# EAGLE schematic stepperDriverTop (EAGLE 9.6.2)

## Sheet 1 of 3: Motor Driver
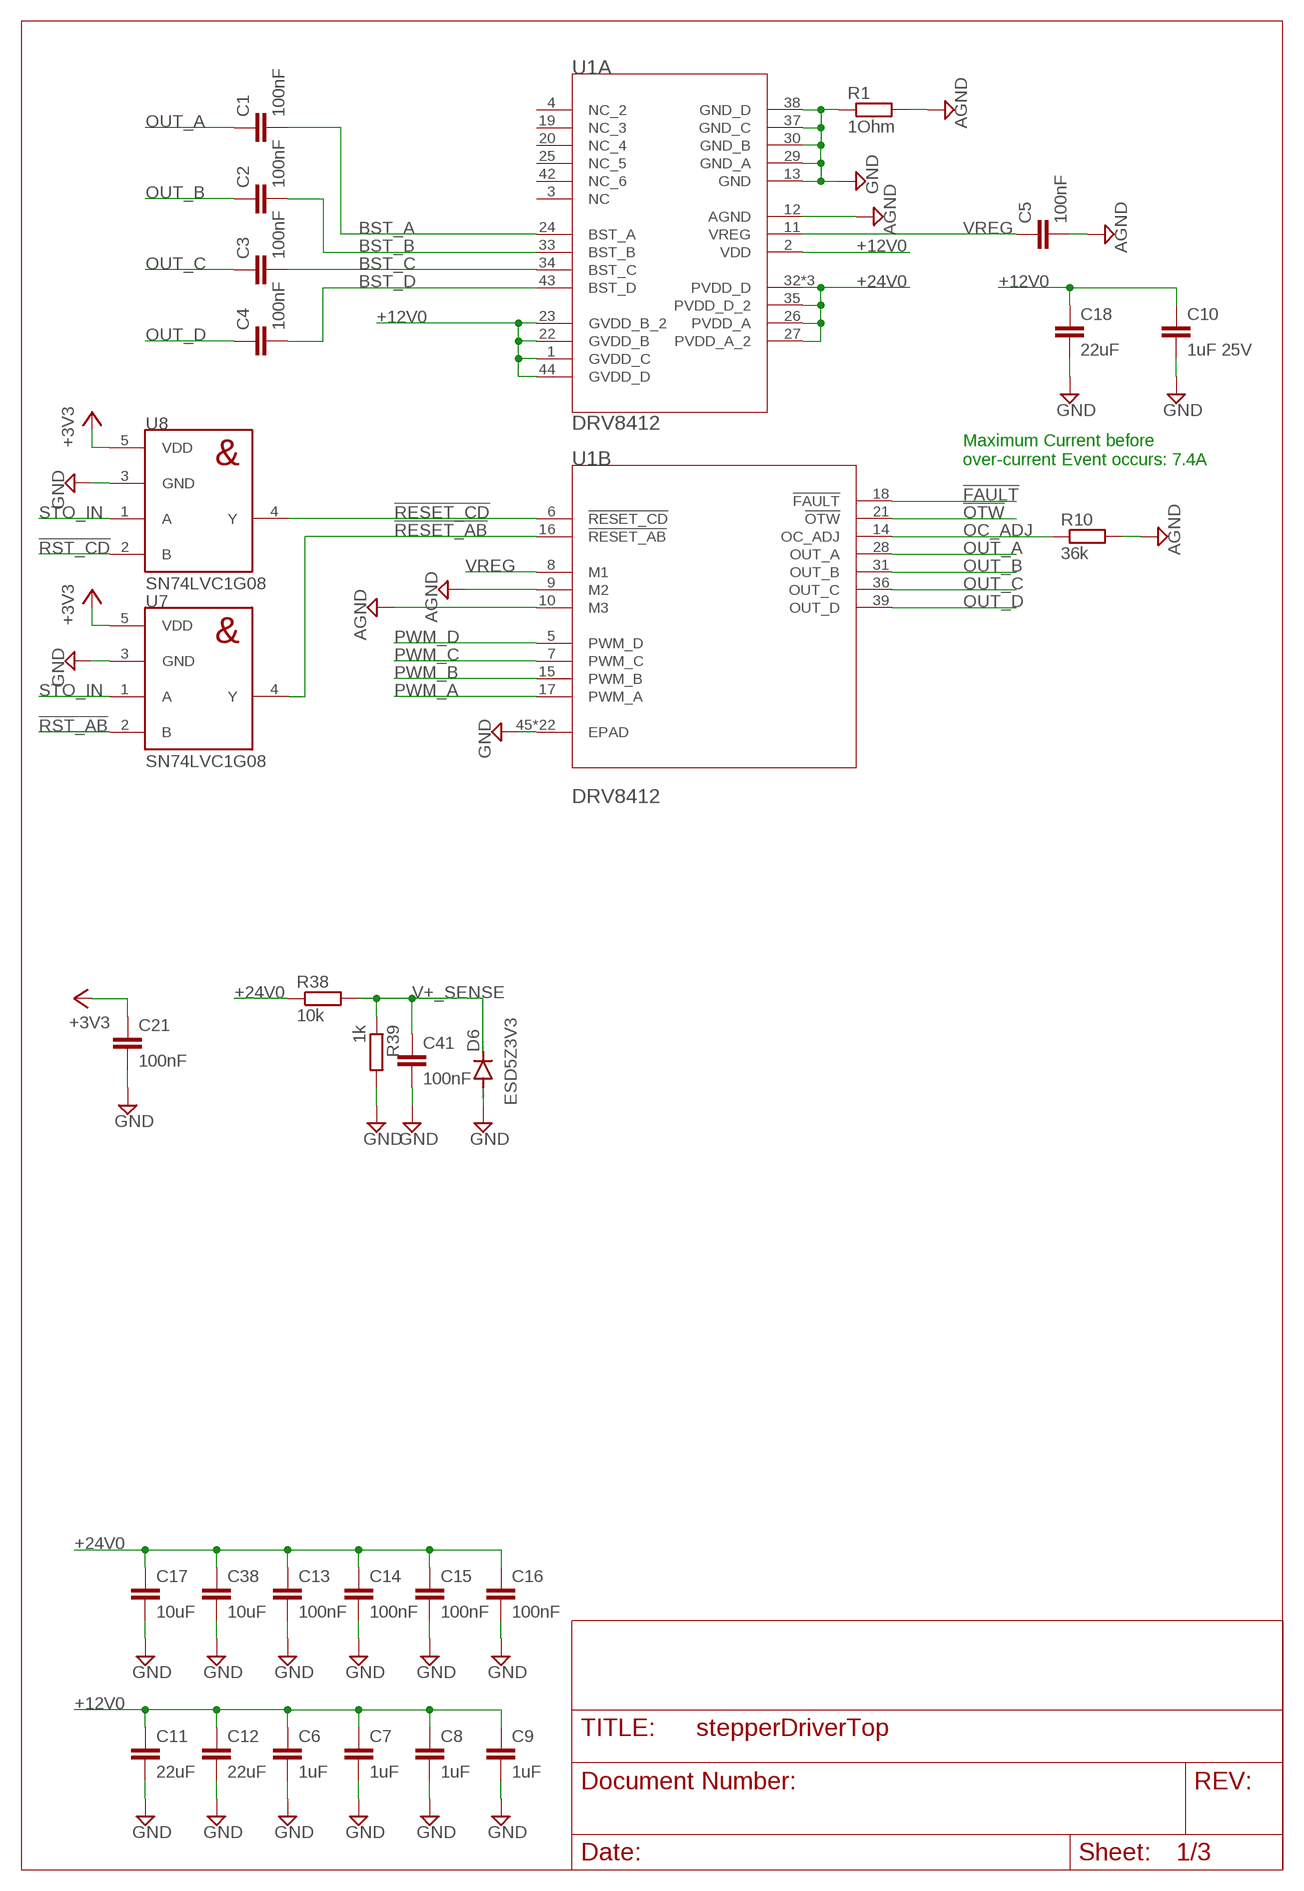
[diagram p0: schematic, sheet 1]

### Parts
C1  100nF  C-EUC0603  [C0603]
C2  100nF  C-EUC0603  [C0603]
C3  100nF  C-EUC0603  [C0603]
C4  100nF  C-EUC0603  [C0603]
C5  100nF  C-EUC0402  [C0402]
C6  1uF  C-EUC0402  [C0402]
C7  1uF  C-EUC0402  [C0402]
C8  1uF  C-EUC0402  [C0402]
C9  1uF  C-EUC0402  [C0402]
C10  1uF 25V  C-EUC0402  [C0402]
C11  22uF  C-EUC0805  [C0805]
C12  22uF  C-EUC0805  [C0805]
C13  100nF  C-EUC0402  [C0402]
C14  100nF  C-EUC0402  [C0402]
C15  100nF  C-EUC0402  [C0402]
C16  100nF  C-EUC0402  [C0402]
C17  10uF  C-EUC1206  [C1206]
C18  22uF  C-EUC0805  [C0805]
C21  100nF  C-EUC0402  [C0402]
C38  10uF  C-EUC1206  [C1206]
C41  100nF  C-EUC0402  [C0402]
D6  ESD5Z3V3  DIODE-SOD523  [SOD523]
R1  1Ohm  R-EU_R0402  [R0402]
R10  36k  R-EU_R0402  [R0402]
R38  10k  R-EU_R0402  [R0402]
R39  1k  R-EU_R0402  [R0402]
U1  DRV8412  DRV8412DDW44  [SOP63P810X120-45T350X740N]
U7  SN74LVC1G08  [SOT95P240X110-5]
U8  SN74LVC1G08  [SOT95P240X110-5]

### Nets
!FAULT: U1.18(B:!FAULT) ; also sheet 2
!OTW: U1.21(B:!OTW) ; also sheet 2
!RESET_AB: U1.16(B:!RESET_AB) U7.4(Y)
!RESET_CD: U1.6(B:!RESET_CD) U8.4(Y)
!RST_AB: U7.2(B) ; also sheet 2
!RST_CD: U8.2(B) ; also sheet 2
+3V3: C21.1 U7.5(VDD) U8.5(VDD) ; also sheet 2,3
+12V0: C6.1 C7.1 C8.1 C9.1 C10.1 C11.1 C12.1 C18.1 U1.1(A:GVDD_C) U1.2(A:VDD) U1.22(A:GVDD_B) U1.23(A:GVDD_B_2) U1.44(A:GVDD_D) ; also sheet 3
+24V0: C13.1 C14.1 C15.1 C16.1 C17.1 C38.1 R38.1 U1.26(A:PVDD_A) U1.27(A:PVDD_A_2) U1.32(A:PVDD_D) U1.35(A:PVDD_D_2) U1.40(A:PVDD_D) U1.41(A:PVDD_D) ; also sheet 3
AGND: C5.2 R1.2 R10.2 U1.9(B:M2) U1.10(B:M3) U1.12(A:AGND)
BST_A: C1.2 U1.24(A:BST_A)
BST_B: C2.2 U1.33(A:BST_B)
BST_C: C3.2 U1.34(A:BST_C)
BST_D: C4.2 U1.43(A:BST_D)
GND: C6.2 C7.2 C8.2 C9.2 C10.2 C11.2 C12.2 C13.2 C14.2 C15.2 C16.2 C17.2 C18.2 C21.2 C38.2 C41.2 D6.A R1.1 R39.2 U1.13(A:GND) U1.29(A:GND_A) U1.30(A:GND_B) U1.37(A:GND_C) U1.38(A:GND_D) U1.45(B:EPAD) U1.V_1(B:EPAD) U1.V_2(B:EPAD) U1.V_3(B:EPAD) U1.V_4(B:EPAD) U1.V_5(B:EPAD) U1.V_6(B:EPAD) U1.V_7(B:EPAD) U1.V_8(B:EPAD) U1.V_9(B:EPAD) U1.V_10(B:EPAD) U1.V_11(B:EPAD) U1.V_12(B:EPAD) U1.V_13(B:EPAD) U1.V_14(B:EPAD) U1.V_15(B:EPAD) U1.V_16(B:EPAD) U1.V_17(B:EPAD) U1.V_18(B:EPAD) U1.V_19(B:EPAD) U1.V_20(B:EPAD) U1.V_21(B:EPAD) U7.3(GND) U8.3(GND) ; also sheet 2,3
OC_ADJ: R10.1 U1.14(B:OC_ADJ)
OUT_A: C1.1 U1.28(B:OUT_A) ; also sheet 3
OUT_B: C2.1 U1.31(B:OUT_B) ; also sheet 3
OUT_C: C3.1 U1.36(B:OUT_C) ; also sheet 3
OUT_D: C4.1 U1.39(B:OUT_D) ; also sheet 3
PWM_A: U1.17(B:PWM_A) ; also sheet 2
PWM_B: U1.15(B:PWM_B) ; also sheet 2
PWM_C: U1.7(B:PWM_C) ; also sheet 2
PWM_D: U1.5(B:PWM_D) ; also sheet 2
STO_IN: U7.1(A) U8.1(A) ; also sheet 2,3
V+_SENSE: C41.1 D6.C R38.2 R39.1 ; also sheet 2
VREG: C5.1 U1.8(B:M1) U1.11(A:VREG)
Unconnected: U1.3(A:NC) U1.4(A:NC_2) U1.19(A:NC_3) U1.20(A:NC_4) U1.25(A:NC_5) U1.42(A:NC_6)

### Notes on the sheet
- Maximum Current before 
  over-current Event occurs: 7.4A

## Sheet 2 of 3: Microcontroller
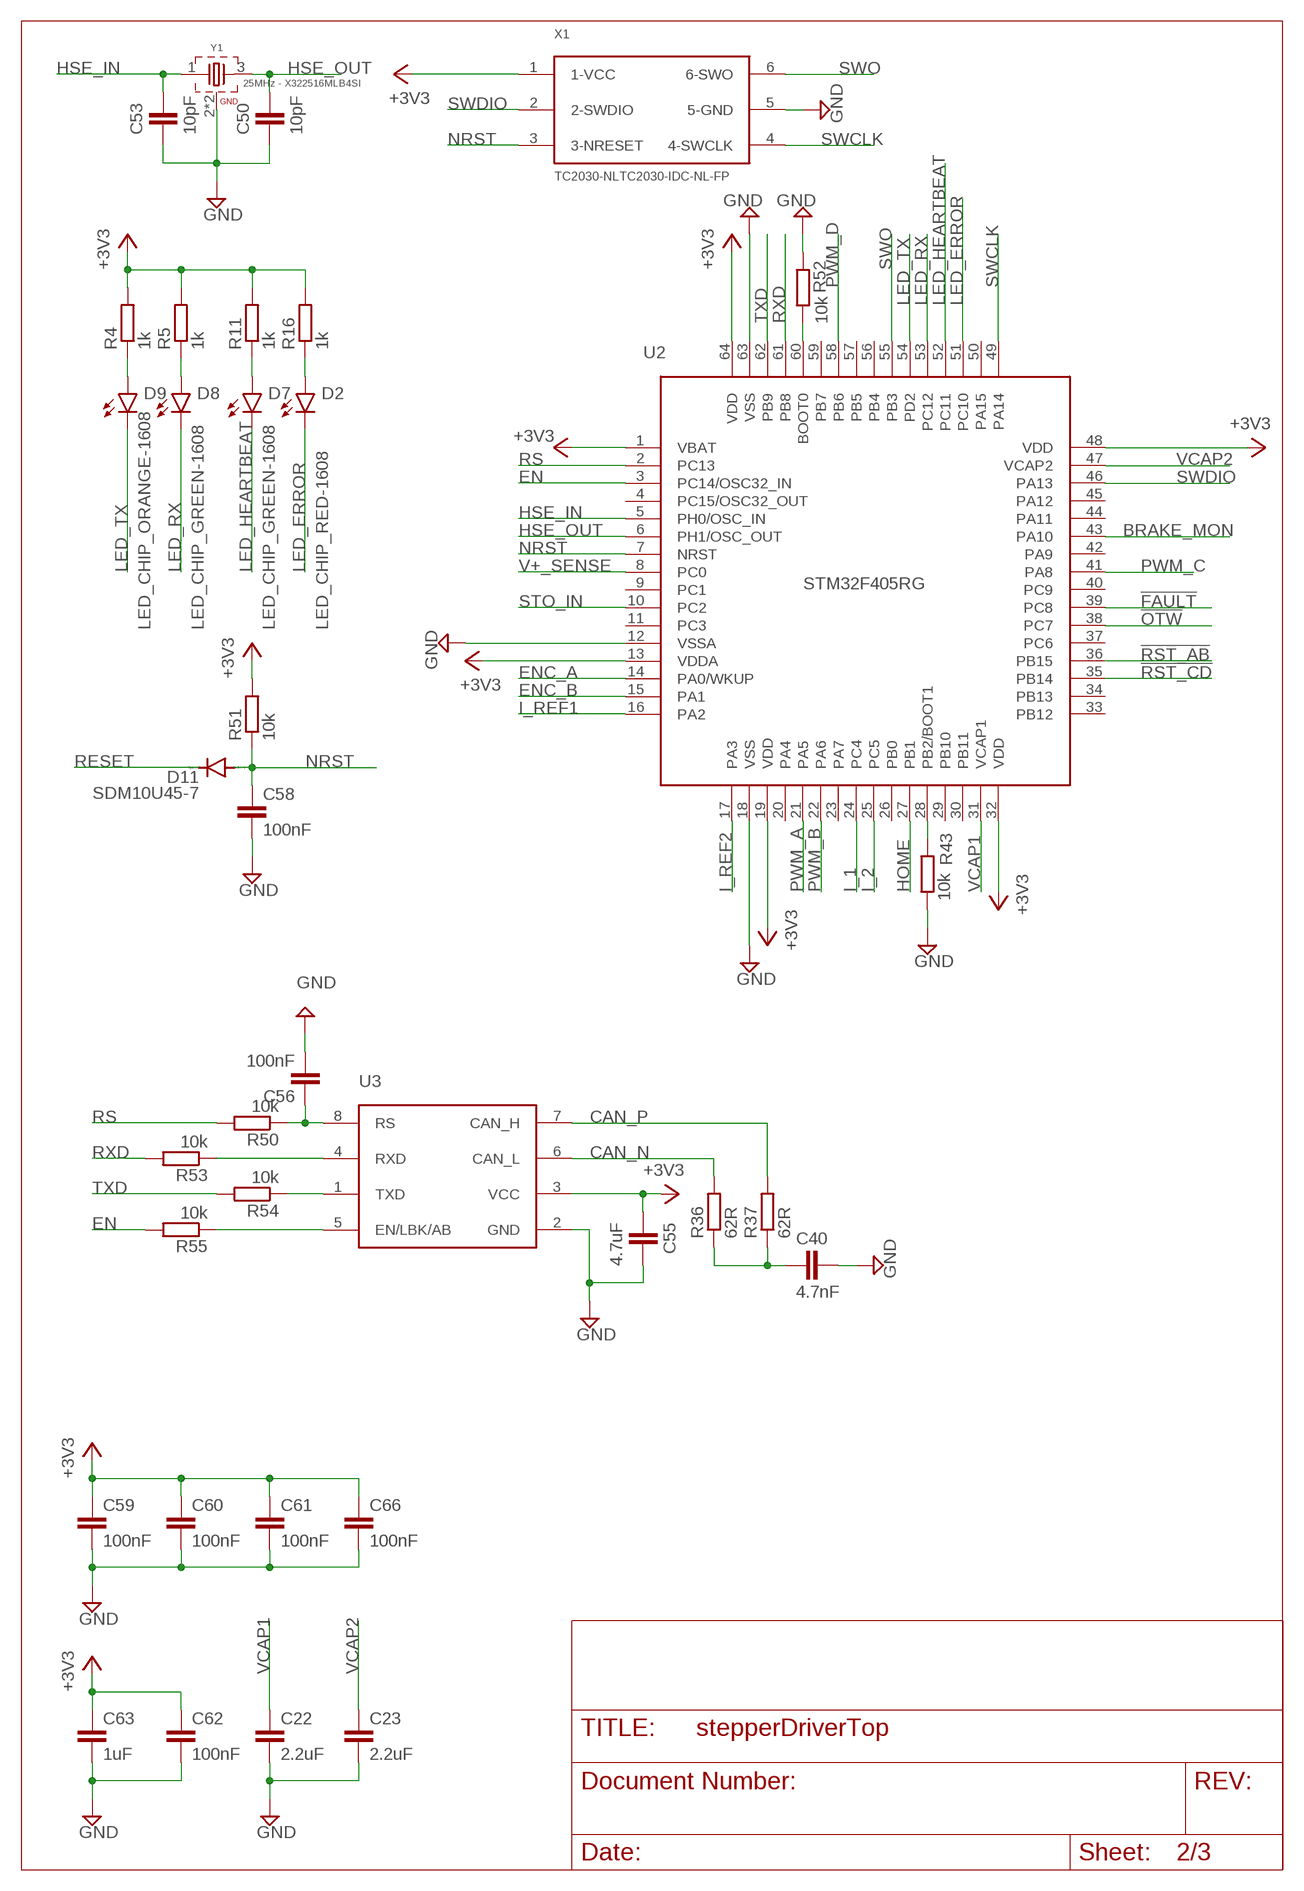
[diagram p1: schematic, sheet 2]

### Parts
C22  2.2uF  C-EUC0603  [C0603]
C23  2.2uF  C-EUC0603  [C0603]
C40  4.7nF  C-EUC0402  [C0402]
C50  10pF  C-EUC0402  [C0402]
C53  10pF  C-EUC0402  [C0402]
C55  4.7uF  C-EUC0402  [C0402]
C56  100nF  C-EUC0402  [C0402]
C58  100nF  C-EUC0402  [C0402]
C59  100nF  C-EUC0402  [C0402]
C60  100nF  C-EUC0402  [C0402]
C61  100nF  C-EUC0402  [C0402]
C62  100nF  C-EUC0402  [C0402]
C63  1uF  C-EUC0402  [C0402]
C66  100nF  C-EUC0402  [C0402]
D2  LED_CHIP_RED-1608  [LEDC1608X39N_R]
D7  LED_CHIP_GREEN-1608  [LEDC1608X39N_G]
D8  LED_CHIP_GREEN-1608  [LEDC1608X39N_G]
D9  LED_CHIP_ORANGE-1608  LED_CHIP_GREEN-1608  [LEDC1608X39N_G]
D11  SDM10U45-7  DIODE-SOD523  [SOD523]
R4  1k  R-EU_R0402  [R0402]
R5  1k  R-EU_R0402  [R0402]
R11  1k  R-EU_R0402  [R0402]
R16  1k  R-EU_R0402  [R0402]
R36  62R  R-EU_R0603  [R0603]
R37  62R  R-EU_R0603  [R0603]
R43  10k  R-EU_R0402  [R0402]
R50  10k  R-EU_R0402  [R0402]
R51  10k  R-EU_R0402  [R0402]
R52  10k  R-EU_R0402  [R0402]
R53  10k  R-EU_R0402  [R0402]
R54  10k  R-EU_R0402  [R0402]
R55  10k  R-EU_R0402  [R0402]
U2  STM32F405RGLQFP64  [QFP50P1200X1200X120-64]
U3  SN65HVD23X-Q1D0008A  [SOIC127P599X175-8N]
X1  TC2030-NLTC2030-IDC-NL-FP  [TC2030-NL]
Y1  25MHz - X322516MLB4SI  WE-XTAL_CFPX-180_830059800  [WE-XTAL_CFPX-180]

### Nets
!FAULT: U2.39(PC8) ; also sheet 1
!OTW: U2.38(PC7) ; also sheet 1
!RST_AB: U2.36(PB15) ; also sheet 1
!RST_CD: U2.35(PB14) ; also sheet 1
+3V3: C55.2 C59.1 C60.1 C61.1 C62.1 C63.1 C66.1 R4.2 R5.2 R11.2 R16.2 R51.2 U2.1(VBAT) U2.13(VDDA) U2.19(VDD) U2.32(VDD) U2.48(VDD) U2.64(VDD) U3.3(VCC) X1.1(1-VCC) ; also sheet 1,3
BRAKE_MON: U2.43(PA10) ; also sheet 3
CAN_N [diff pairs]: R36.2 U3.6(CAN_L) ; also sheet 3
CAN_P [diff pairs]: R37.2 U3.7(CAN_H) ; also sheet 3
EN: R55.2 U2.3(PC14/OSC32_IN)
ENC_A: U2.14(PA0/WKUP) ; also sheet 3
ENC_B: U2.15(PA1) ; also sheet 3
GND: C22.2 C23.2 C40.1 C50.2 C53.2 C55.1 C56.2 C58.2 C59.2 C60.2 C61.2 C62.2 C63.2 C66.2 R43.1 R52.1 U2.12(VSSA) U2.18(VSS) U2.63(VSS) U3.2(GND) X1.5(5-GND) Y1.2(GND) Y1.4(GND) ; also sheet 1,3
HOME: U2.27(PB1) ; also sheet 3
HSE_IN: C53.1 U2.5(PH0/OSC_IN) Y1.1
HSE_OUT: C50.1 U2.6(PH1/OSC_OUT) Y1.3
I_1: U2.24(PC4) ; also sheet 3
I_2: U2.25(PC5) ; also sheet 3
I_REF1: U2.16(PA2) ; also sheet 3
I_REF2: U2.17(PA3) ; also sheet 3
LED_ERROR: D2.1(C) U2.51(PC10)
LED_HEARTBEAT: D7.1(C) U2.52(PC11)
LED_RX: D8.1(C) U2.53(PC12)
LED_TX: D9.1(C) U2.54(PD2)
N$1: D9.2(A) R4.1
N$2: D8.2(A) R5.1
N$3: D7.2(A) R11.1
N$4: D2.2(A) R16.1
N$21: C40.2 R36.1 R37.1
N$24: R43.2 U2.28(PB2/BOOT1)
N$25: R52.2 U2.60(BOOT0)
N$26: C56.1 R50.1 U3.8(RS)
N$27: R53.1 U3.4(RXD)
N$28: R54.1 U3.1(TXD)
N$29: R55.1 U3.5(EN/LBK/AB)
NRST: C58.1 D11.A R51.1 U2.7(NRST) X1.3(3-NRESET)
PWM_A: U2.21(PA5) ; also sheet 1
PWM_B: U2.22(PA6) ; also sheet 1
PWM_C: U2.41(PA8) ; also sheet 1
PWM_D: U2.58(PB6) ; also sheet 1
RESET: D11.C
RS: R50.2 U2.2(PC13)
RXD: R53.2 U2.61(PB8)
STO_IN: U2.10(PC2) ; also sheet 1,3
SWCLK: U2.49(PA14) X1.4(4-SWCLK)
SWDIO: U2.46(PA13) X1.2(2-SWDIO)
SWO: U2.55(PB3) X1.6(6-SWO)
TXD: R54.2 U2.62(PB9)
V+_SENSE: U2.8(PC0) ; also sheet 1
VCAP1: C22.1 U2.31(VCAP1)
VCAP2: C23.1 U2.47(VCAP2)
Unconnected: U2.4(PC15/OSC32_OUT) U2.9(PC1) U2.11(PC3) U2.20(PA4) U2.23(PA7) U2.26(PB0) U2.29(PB10) U2.30(PB11) U2.33(PB12) U2.34(PB13) U2.37(PC6) U2.40(PC9) U2.42(PA9) U2.44(PA11) U2.45(PA12) U2.50(PA15) U2.56(PB4) U2.57(PB5) U2.59(PB7)

## Sheet 3 of 3: Current Sensing and Connectors
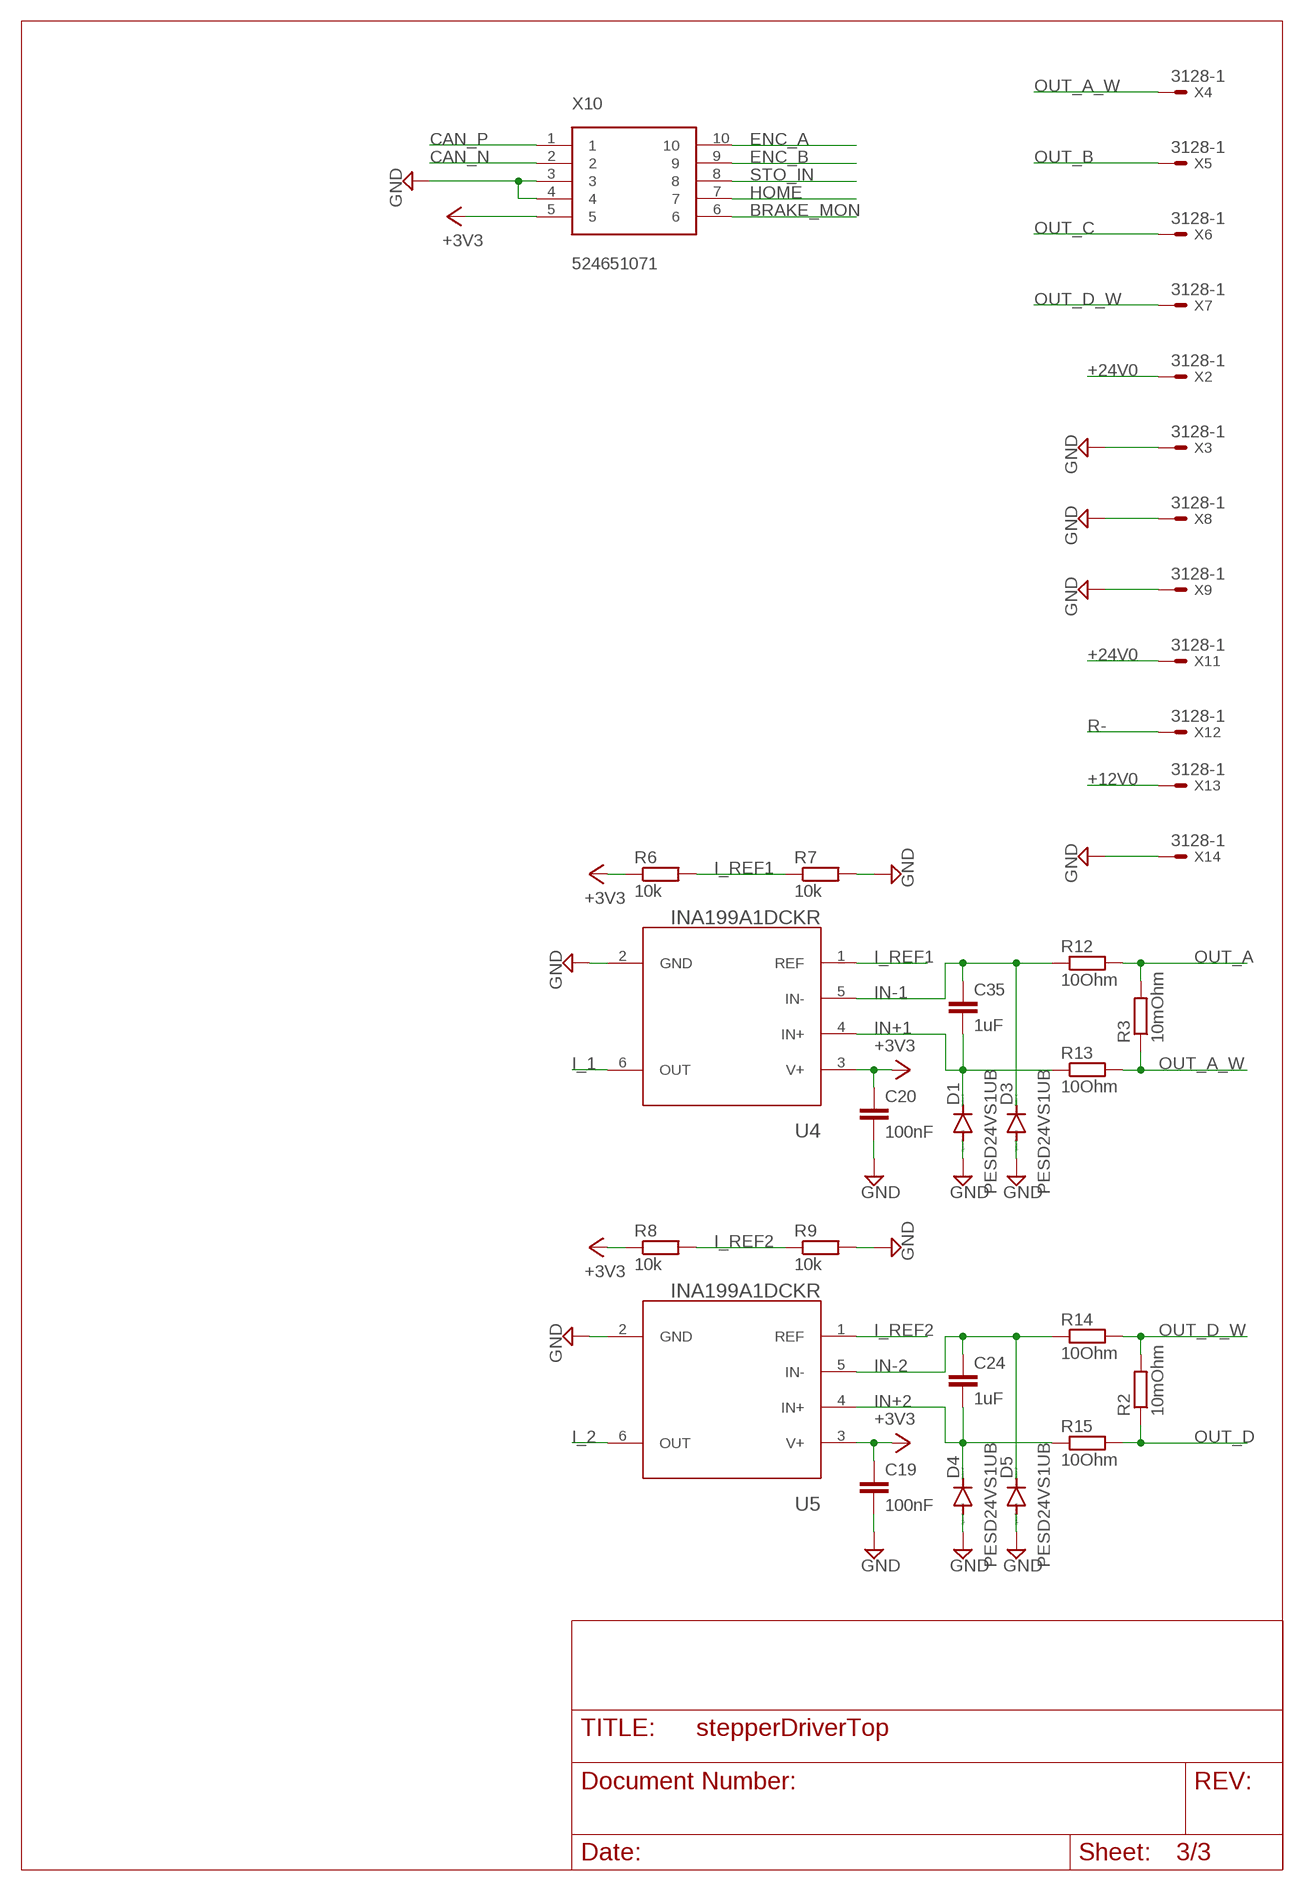
[diagram p2: schematic, sheet 3]

### Parts
C19  100nF  C-EUC0402  [C0402]
C20  100nF  C-EUC0402  [C0402]
C24  1uF  C-EUC0402  [C0402]
C35  1uF  C-EUC0402  [C0402]
D1  PESD24VS1UB  DIODE-SOD523  [SOD523]
D3  PESD24VS1UB  DIODE-SOD523  [SOD523]
D4  PESD24VS1UB  DIODE-SOD523  [SOD523]
D5  PESD24VS1UB  DIODE-SOD523  [SOD523]
R2  10mOhm  R-EU_R0805  [R0805]
R3  10mOhm  R-EU_R0805  [R0805]
R6  10k  R-EU_R0402  [R0402]
R7  10k  R-EU_R0402  [R0402]
R8  10k  R-EU_R0402  [R0402]
R9  10k  R-EU_R0402  [R0402]
R12  10Ohm  R-EU_R0402  [R0402]
R13  10Ohm  R-EU_R0402  [R0402]
R14  10Ohm  R-EU_R0402  [R0402]
R15  10Ohm  R-EU_R0402  [R0402]
U4  INA199A1DCKR  INA199SC70  [SOP65P210X110-6N]
U5  INA199A1DCKR  INA199SC70  [SOP65P210X110-6N]
X2  3128-1  3128-10.6MM  [3128-1]
X3  3128-1  3128-10.6MM  [3128-1]
X4  3128-1  3128-10.6MM  [3128-1]
X5  3128-1  3128-10.6MM  [3128-1]
X6  3128-1  3128-10.6MM  [3128-1]
X7  3128-1  3128-10.6MM  [3128-1]
X8  3128-1  3128-10.6MM  [3128-1]
X9  3128-1  3128-10.6MM  [3128-1]
X10  524651071  524651071SMD  [524651071]
X11  3128-1  3128-10.6MM  [3128-1]
X12  3128-1  3128-10.6MM  [3128-1]
X13  3128-1  3128-10.6MM  [3128-1]
X14  3128-1  3128-10.6MM  [3128-1]

### Nets
+3V3: C19.1 C20.1 R6.1 R8.1 U4.3(V+) U5.3(V+) X10.5 ; also sheet 1,2
+12V0: X13.PIN1(S) ; also sheet 1
+24V0: X2.PIN1(S) X11.PIN1(S) ; also sheet 1
BRAKE_MON: X10.6 ; also sheet 2
CAN_N [diff pairs]: X10.2 ; also sheet 2
CAN_P [diff pairs]: X10.1 ; also sheet 2
ENC_A: X10.10 ; also sheet 2
ENC_B: X10.9 ; also sheet 2
GND: C19.2 C20.2 D1.A D3.A D4.A D5.A R7.2 R9.2 U4.2(GND) U5.2(GND) X3.PIN1(S) X8.PIN1(S) X9.PIN1(S) X10.3 X10.4 X14.PIN1(S) ; also sheet 1,2
HOME: X10.7 ; also sheet 2
I_1: U4.6(OUT) ; also sheet 2
I_2: U5.6(OUT) ; also sheet 2
I_REF1: R6.2 R7.1 U4.1(REF) ; also sheet 2
I_REF2: R8.2 R9.1 U5.1(REF) ; also sheet 2
IN+1: C35.2 D1.C R13.1 U4.4(IN+)
IN+2: C24.2 D4.C R15.1 U5.4(IN+)
IN-1: C35.1 D3.C R12.1 U4.5(IN-)
IN-2: C24.1 D5.C R14.1 U5.5(IN-)
OUT_A: R3.2 R12.2 ; also sheet 1
OUT_A_W: R3.1 R13.2 X4.PIN1(S)
OUT_B: X5.PIN1(S) ; also sheet 1
OUT_C: X6.PIN1(S) ; also sheet 1
OUT_D: R2.1 R15.2 ; also sheet 1
OUT_D_W: R2.2 R14.2 X7.PIN1(S)
R-: X12.PIN1(S)
STO_IN: X10.8 ; also sheet 1,2

## Library data of the parts
C1-C24 C35 C38 C40 C41 C50 C53 C55 C56 C58-C63 C66 = rcl:C-EU: CAPACITOR, European symbol; SPICEPREFIX: C
D1 D3-D6 D11 = diode:DIODE-: DIODE
D2 = Opto-Electronic:LED_CHIP: LED - Generic; CATEGORY: Opto-Electronic; COLOR: Red; SUB-CATEGORY: LED
D7-D9 = Opto-Electronic:LED_CHIP: LED - Generic; CATEGORY: Opto-Electronic; COLOR: Green; SUB-CATEGORY: LED
R1-R16 R36-R39 R43 R50-R55 = rcl:R-EU_: RESISTOR, European symbol; SPICEPREFIX: R
U1 = stepperDriver:DRV8412: DRV8412 The DRV841x2 are high-performance, integrated dual full-bridge motor driver with an advanced protection system. Because of the low RDS(on) of the H-Bridge MOSFETs and intelligent gate drive design, the efficiency of these motor drivers can be up to 97%. This high efficiency enables the use of smaller power supplies and heatsinks, and the devices are good candidates for energy-efficient applications. Datasheet Link <https://www.ti.com/lit/ds/symlink/drv8412.pdf>
U2 = stepperDriver:STM32F405RG: STM32F405RGT6 ST MICROELECTRONICS LQFP-64_10X10X05P ROHS Datasheet Link <https://www.st.com/resource/en/datasheet/stm32f405rg.pdf>
U3 = stepperDriver:SN65HVD23X-Q1: SN65HVD230DR CAN 1/1 1MBPS 3V ~ 3.6V SOIC-8_150MIL ROHS Datasheet Link <https://www.ti.com/lit/ds/symlink/sn65hvd230.pdf>
U4 U5 = stepperDriver:INA199: INA199 The INA199 series of voltage-output, current-shunt monitors (also called current-sense amplifiers) are commonly used for overcurrent protection, precision- current measurement for system optimization, or in closed-loop feedback circuits. This series of devices can sense drops across shunt resistors at common- mode voltages from –0.3 V to 26 V, independent of the supply voltage. Three fixed gains are available: 50 V/V, 100 V/V, and 200 V/V. The low offset of the zero-drift architecture enables current sensing with maximum drops across the shunt as low as 10-mV full-scale. Datasheet Link <https://www.ti.com/lit/ds/symlink/ina199.pdf>
U7 U8 = stepperDriver:SN74LVC1G08: SN74LVC1G08 This single 2-input positive-AND gate is designed for 1.65-V to 5.5-V VCC operation. The SN74LVC1G08 device performs the Boolean function or Y = A • B or Y = A + B in positive logic. The CMOS device has high output drive while maintaining low static power dissipation over a broad VCC operating range. The SN74LVC1G08 is available in a variety of packages, including the ultra-small DPW package with a body size of 0.8 mm × 0.8 mm. Datasheet Link <https://www.ti.com/lit/ds/symlink/sn74lvc1g08.pdf>
X1 = connectors:TC2030-NL
X2-X9 X11-X14 = connectors:3128-1: 3128-1 Solder mount in 0,61 min. mounting hole Datasheet Link <https://www.digikey.de/product-detail/de/mill-max-manufacturing-corp/3128-1-00-15-00-00-08-0/ED90539-ND/436741>
X10 = connectors:524651071: 524651071 SlimStack Board-to-Board Connector, 0.80mm Pitch, Floating Series, Rigid Type Receptacle, 4.50 to 7.00mm Mated Height, 10 Circuits, without Boss
Y1 = Wurth_Quartz Crystals & Oscillators_WE-XTAL:WE-XTAL_CFPX-180: WE-XTAL Quartz Crystal Characteristics Industry standard packages <https://katalog.we-online.com/media/images/v2/o135919v209%20Family_WE-XTAL_IQXC-42.jpg> Details see: https://katalog.we-online.com/en/pbs/WE-XTAL Updated by Ella Wu , 2019-09-03 2019 (C) Wurth Elektronik; C-LOAD: 10pF; DATASHEET-URL: https://www.we-online.com/catalog/datasheet/830059800.pdf; MOUNT: SMT; PART-NUMBER: 830059800; STABILITY: 10ppm; TOLERANCE: ±10ppm; VALUE: 25MHz